# EAGLE design Loconet-QuadOD (EAGLE 7.7.0)
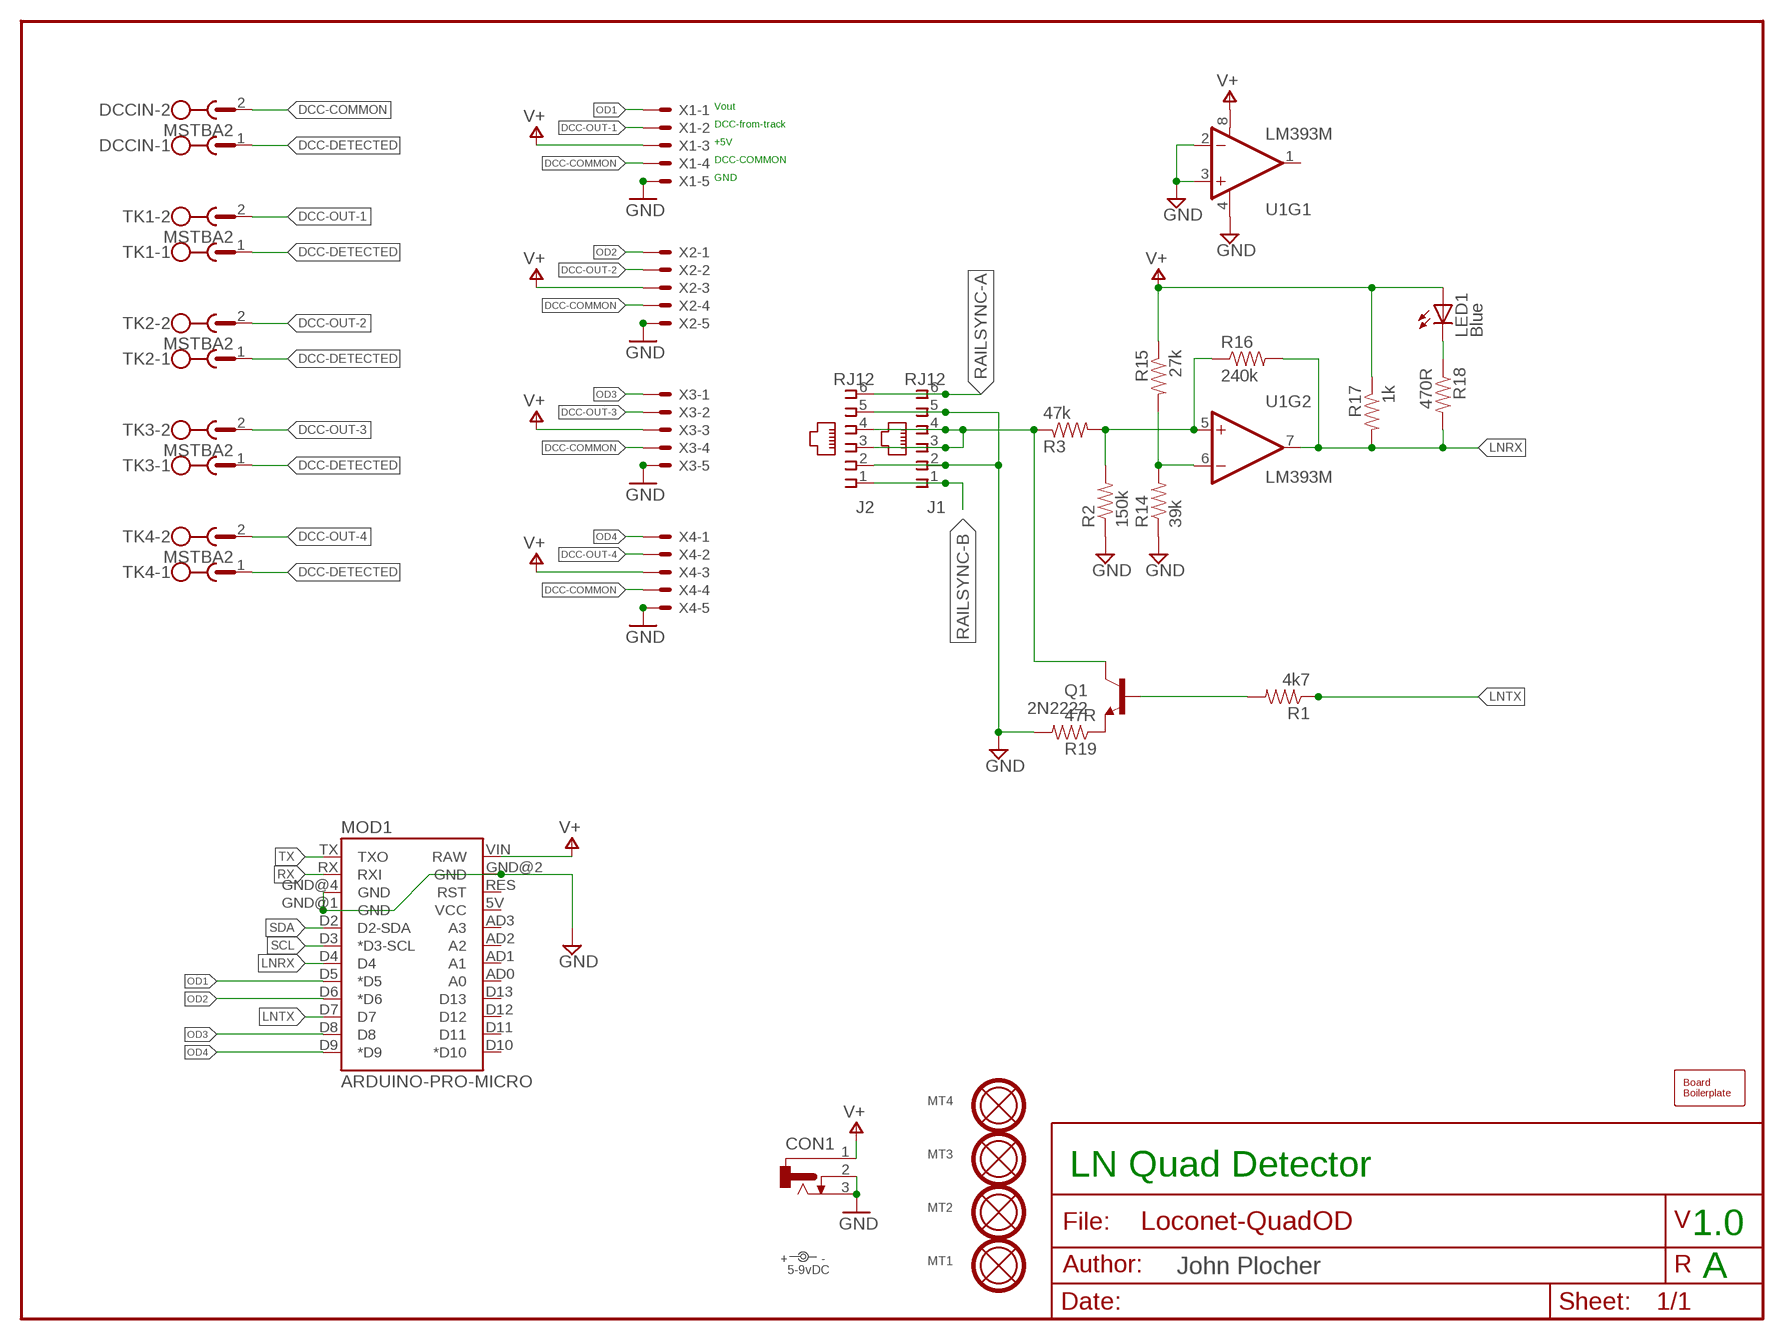
[diagram p0: schematic, sheet 1]

## Parts
BOARD1  BOARD100X100-NOHOLES  [BOARD-SEEED10X10-NOHOLES]
CON1  CONNECTOR-DC-POWER-RA  [DCJ0202]
DCCIN  MSTBA2  CONNECTOR-MSTBA2-ORIG  [MSTBA2]
J1  RJ12  CONNECTOR-RJ25CORCOM  [RJ25]
J2  RJ12  CONNECTOR-RJ25CORCOM  [RJ25]
LED1  Blue  LED0805-LED  [0805-LED]
MOD1  ARDUINO-PRO-MICRO  [ARDUINO-PRO-MICRO-NOSILK]
MT1  MOUNTINGHOLE  [MOUNTINGHOLE]
MT2  MOUNTINGHOLE  [MOUNTINGHOLE]
MT3  MOUNTINGHOLE  [MOUNTINGHOLE]
MT4  MOUNTINGHOLE  [MOUNTINGHOLE]
Q1  2N2222  NPN-SOT23  [SOT23]
R1  4k7  R0805-RES  [0805-RES]
R2  150k  R0805-RES  [0805-RES]
R3  47k  R0805-RES  [0805-RES]
R14  39k  R0805-RES  [0805-RES]
R15  27k  R0805-RES  [0805-RES]
R16  240k  R0805-RES  [0805-RES]
R17  1k  R0805-RES  [0805-RES]
R18  470R  R0805-RES  [0805-RES]
R19  47R  R0805-RES  [0805-RES]
TK1  MSTBA2  CONNECTOR-MSTBA2-ORIG  [MSTBA2]
TK2  MSTBA2  CONNECTOR-MSTBA2-ORIG  [MSTBA2]
TK3  MSTBA2  CONNECTOR-MSTBA2-ORIG  [MSTBA2]
TK4  MSTBA2  CONNECTOR-MSTBA2-ORIG  [MSTBA2]
U1  LM393M  [SO08]
U$1  5-9vDC  DOC-POWER_LABEL  [PWR_LABEL]
X1  KK-156-5  [KK-156-5]
X2  KK-156-5  [KK-156-5]
X3  KK-156-5  [KK-156-5]
X4  KK-156-5  [KK-156-5]

## Nets
DCC-COMMON: DCCIN.2 X1.4 X2.4 X3.4 X4.4
DCC-DETECTED: DCCIN.1 TK1.1 TK2.1 TK3.1 TK4.1
DCC-OUT-1: TK1.2 X1.2
DCC-OUT-2: TK2.2 X2.2
DCC-OUT-3: TK3.2 X3.2
DCC-OUT-4: TK4.2 X4.2
GND: CON1.2 CON1.3 J1.2 J1.5 J2.2 J2.5 MOD1.GND@1(GND) MOD1.GND@2(GND) MOD1.GND@4(GND) R2.1 R14.1 R19.2 U1.2(-IN) U1.3(+IN) U1.4(V-) X1.5 X2.5 X3.5 X4.5
LNRX: MOD1.D4 R16.2 R17.2 R18.2 U1.7(OUT)
LNTX: MOD1.D7 R1.1
LOCONET [Power]: J1.3 J1.4 J2.3 J2.4 Q1.3(C) R3.1
N$1: Q1.1(B) R1.2
N$2: LED1.C R18.1
N$4: R2.2 R3.2 R16.1 U1.5(+IN)
N$5: R14.2 R15.2 U1.6(-IN)
N$11: Q1.2(E) R19.1
OD1: MOD1.D5(*D5) X1.1
OD2: MOD1.D6(*D6) X2.1
OD3: MOD1.D8 X3.1
OD4: MOD1.D9(*D9) X4.1
RAILSYNC-A: J1.6 J2.6
RAILSYNC-B: J1.1 J2.1
RX [signals]: MOD1.RX(RXI)
SCL: MOD1.D3(*D3-SCL)
SDA: MOD1.D2(D2-SDA)
TX [signals]: MOD1.TX(TXO)
V+: CON1.1 LED1.A MOD1.VIN(RAW) R15.1 R17.1 U1.8(V+) X1.3 X2.3 X3.3 X4.3
Unconnected: MOD1.5V(VCC) MOD1.AD0(A0) MOD1.AD1(A1) MOD1.AD2(A2) MOD1.AD3(A3) MOD1.D10(*D10) MOD1.D11 MOD1.D12 MOD1.D13 MOD1.RES(RST) U1.1(OUT)

## Notes on the sheet
- Vout
- DCC-from-track
- +5V
- DCC-COMMON
- GND
- LN Quad Detector
- 1.0
- A

## Library data of the parts
BOARD1 = SPCoast:BOARD
CON1 = SPCoast:CONNECTOR-DC-POWER: DC POWER JACK Source: DCJ0202.pdf
DCCIN TK1-TK4 = SPCoast:CONNECTOR-MSTBA2-ORIG: PHOENIX; MF: FARNELL; MPN: 1757242; OC_FARNELL: 3705171; OC_NEWARK: 71C4161
J1 J2 = SPCoast:CONNECTOR-RJ25: AMP connector
LED1 = SPCoast:LED*
MOD1 = SPCoast:ARDUINO-PRO-MICRO
MT1-MT4 = SPCoast:MOUNTINGHOLE: Mounting hole with top and bottom copper and stop rings
Q1 = SPCoast:NPN: Transistor NPN BJT configuration in SOT23 package. MMBT2222 is the common NPN we use. Double check BCE configuration again layout.
R1-R3 R14-R19 = SPCoast:R*: Resistor Basic schematic elements and footprints for 0603, 1206, and PTH 1/10th watt (small) resistors.
U1 = SPCoast:LM393
U$1 = SPCoast:DOC-POWER_LABEL
X1-X4 = SPCoast:KK-156-5: KK 156 HEADER Source: http://www.molex.com/pdm_docs/sd/026604100_sd.pdf; OC_FARNELL: unknown; OC_NEWARK: unknown

## Net classes
0 default: width 0.203 mm, drill 0.5 mm
1 Power: width 0.305 mm, drill 0.6 mm
2 signals: width 0.254 mm, drill 0.5 mm

## Board
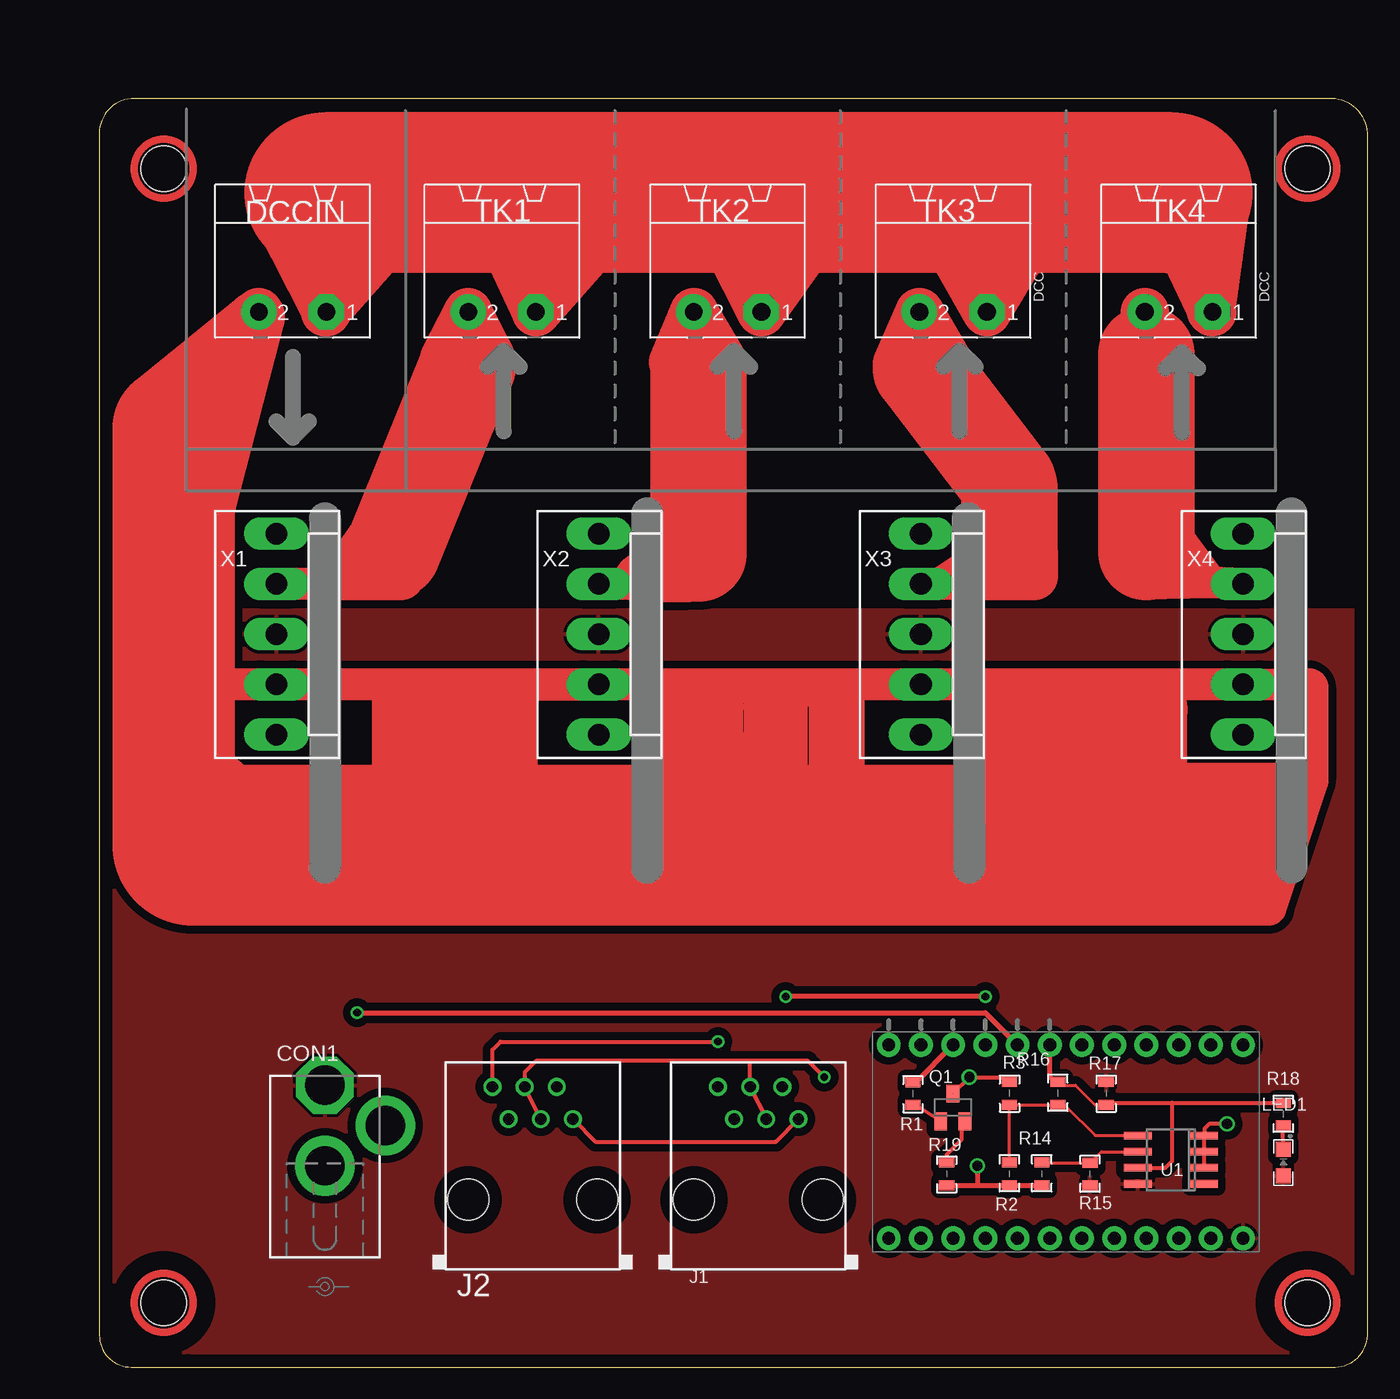
[diagram p1: board, top side]
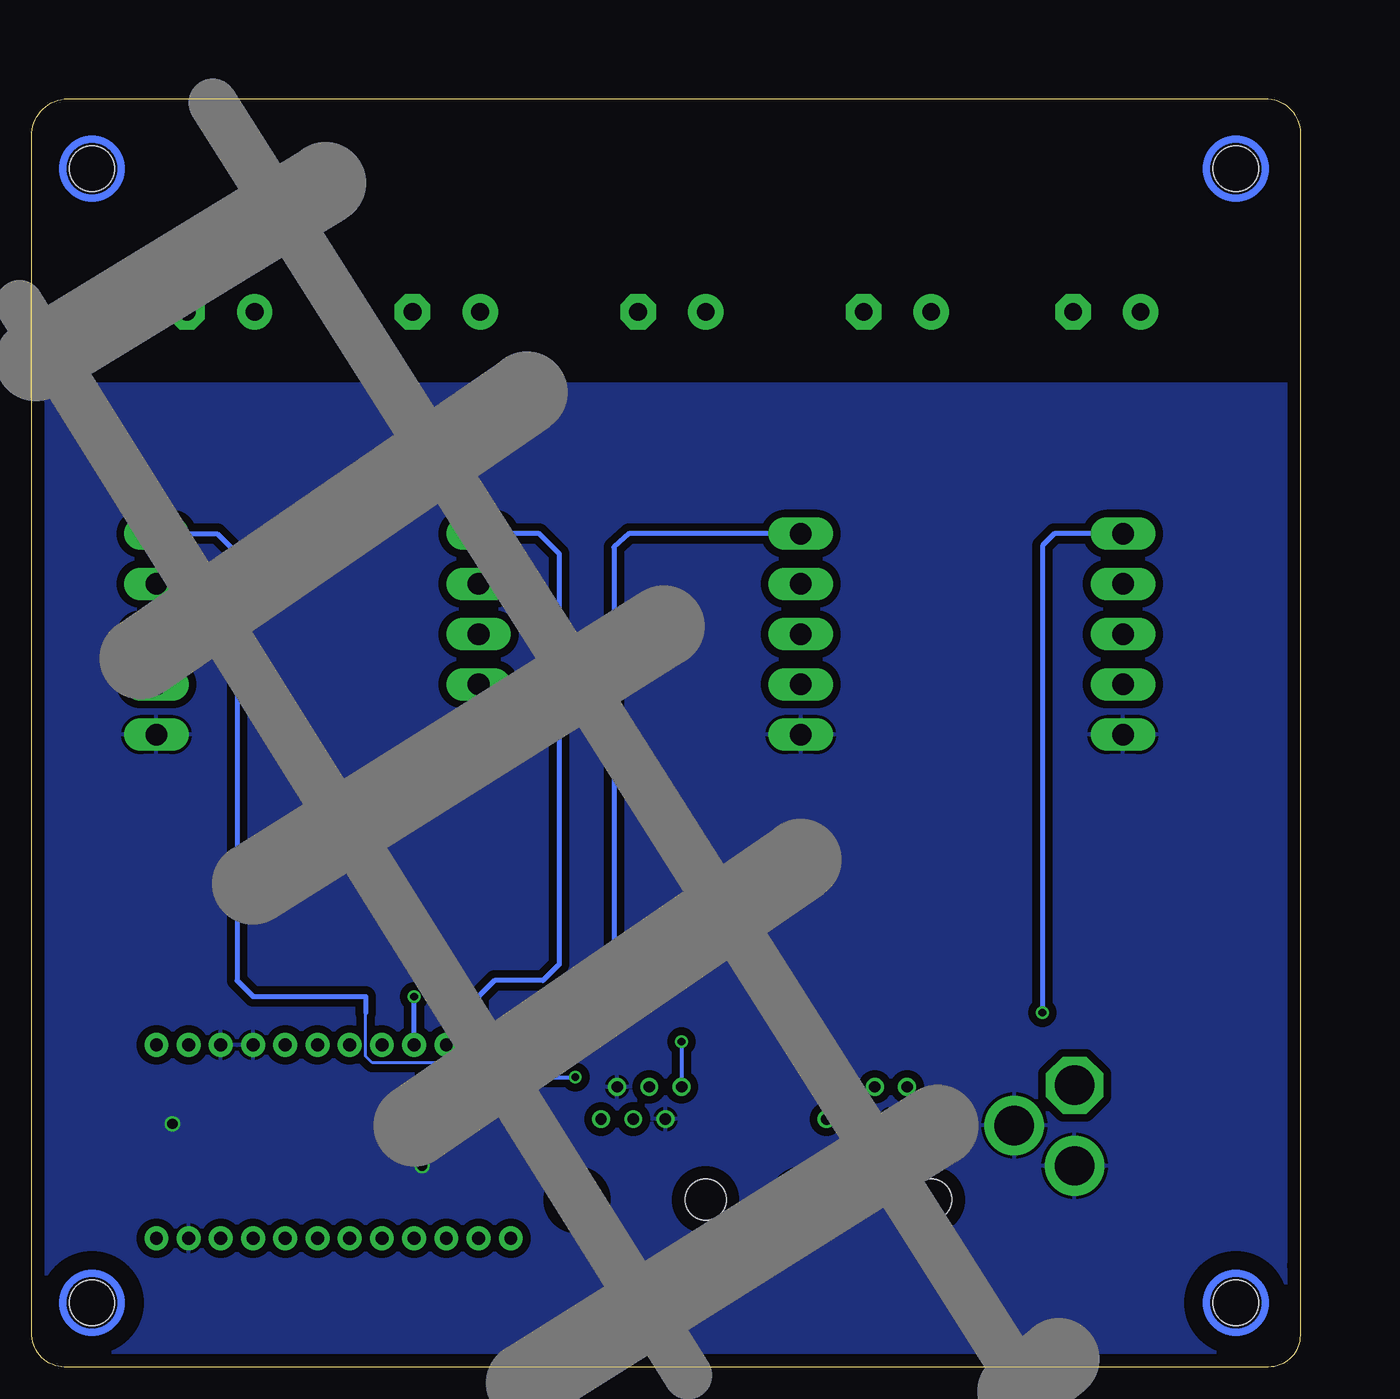
[diagram p2: board, bottom side, seen from below]

Size 100.01 x 100 mm. Coordinates in mm from the lower left corner, seen from the top.
Copper layers (1*16): Top 0.035mm / dielectric 1.5mm / Bottom 0.035mm
Design rules "default": minimum track width 10mil, minimum drill 24mil, track to track 8mil, track to pad 8mil, pad to pad 8mil, via to via 8mil, smd to smd 8mil, copper to edge 40mil, drill to drill 8mil, minimum pad ring 10mil, minimum via ring 8mil, stop-mask expansion 4mil, vias tented up to drill 0mil, thermal gap 10mil

### Footprints (pad centres in the part's own frame; a part is rotated, then mirrored left to right if it is on the bottom)
DCJ0202 = drill 3.1 pad 4.5 octagon: 1 0,3.175 | drill 3.1 pad 4.7: 2 4.763,0; 3 0,-3.175
MSTBA2 = drill 1.397 pad 2.794 octagon: 1 -2.667,5.08 | drill 1.397 pad 2.794: 2 2.667,5.08
RJ25 = drill 0.9 pad 1.4: 1 -3.175,8.89; 2 -1.905,6.35; 3 -0.635,8.89; 4 0.635,6.35; 5 1.905,8.89; 6 3.175,6.35 | hole 3.251: -5.08,0; 5.08,0
0805-LED = smd 1.2 x 1.2: A -1.05,0; C 1.05,0
ARDUINO-PRO-MICRO-NOSILK = drill 1.016 pad 1.88: 5V 7.62,5.08; AD0 7.62,-5.08; AD1 7.62,-2.54; AD2 7.62,0; AD3 7.62,2.54; D2 -7.62,2.54; D3 -7.62,0; D4 -7.62,-2.54; D5 -7.62,-5.08; D6 -7.62,-7.62; D7 -7.62,-10.16; D8 -7.62,-12.7; D9 -7.62,-15.24; D10 7.62,-15.24; D11 7.62,-12.7; D12 7.62,-10.16; D13 7.62,-7.62; GND@1 7.62,10.16; GND@2 -7.62,7.62; GND@4 -7.62,5.08; RES 7.62,7.62; RX -7.62,10.16; TX -7.62,12.7; VIN 7.62,12.7
MOUNTINGHOLE = hole 3.6: 0,0
SOT23 = smd 1 x 1.4: 1 -0.95,-1.1; 2 0.95,-1.1; 3 0,1.1
0805-RES = smd 0.8 x 1.2: 1 -0.9,0; 2 0.9,0
SO08 = smd 0.6 x 2.2: 1 -1.905,-2.6; 2 -0.635,-2.6; 3 0.635,-2.6; 4 1.905,-2.6; 5 1.905,2.6; 6 0.635,2.6; 7 -0.635,2.6; 8 -1.905,2.6
KK-156-5 = drill 1.7 pad 2.184 long: 1 -7.92,0; 2 -3.96,0; 3 0,0; 4 3.96,0; 5 7.92,0

### Placement (x,y rotation side)
BOARD1  0.01,0 0 top
CON1  17.79,19.05 0 top
DCCIN  15.25,88.27 180 top
J1  51.95,13.21 0 top
J2  34.17,13.21 0 top
LED1  93.35,16.13 90 top
MOD1  77.48,17.78 270 top
MT1  5.09,5.08 0 top
MT2  95.26,5.08 0 top
MT3  95.26,94.49 0 top
MT4  5.09,94.49 0 top
Q1  67.29,20.48 0 top
R1  64.14,21.57 270 top
R2  71.76,15.24 90 top
R3  71.76,21.59 270 top
R14  74.3,15.24 90 top
R15  78.11,15.22 90 top
R16  75.57,21.59 90 top
R17  79.38,21.59 270 top
R18  93.35,19.94 90 top
R19  66.81,15.24 270 top
TK1  31.76,88.27 180 top
TK2  49.54,88.27 180 top
TK3  67.32,88.27 180 top
TK4  85.1,88.27 180 top
U1  84.49,16.36 90 top
U$1  17.79,6.35 90 top
X1  13.98,57.79 270 top
X2  39.38,57.79 270 top
X3  64.78,57.79 270 top
X4  90.18,57.79 270 top

### Tracks (layer width: path | path; a pad name or v marks a point on that pad's centre or on a via)
DCC-COMMON
  Top 10.16: 7.5,43.31 6.74,42.68
  Top 11.43: 7.38,41.15 7.5,43.31
  Top 12.7: 81.29,41.15 7.38,41.15
  Top 2.54: 6.08,54.34 6.74,42.68 | 59.06,53.47 59.06,43.82 57.29,43.82 | 57.29,43.82 52.08,43.82 52.08,46.99 | 52.08,46.99 52.08,53.6 44.33,53.6 44.33,46.36 54.62,46.36 54.62,53.34 57.16,53.34 57.16,46.36 | 28.33,53.34 30.87,53.34 30.87,45.6 33.28,45.6 33.28,53.83 X2.4 | 28.33,45.98 25.28,45.98 | 25.28,52.96 22.74,53.72 22.74,43.69 | 95.39,53.57 95.39,53.85 93.99,53.85 X4.4 X3.4 X2.4 | 95.39,46.36 85.1,46.36 85.1,44.45 | 85.1,44.45 94.75,44.58 94.24,42.29 85.73,42.55 85.73,40.64 93.35,40.64 92.97,38.74 82.56,38.74 81.29,36.2 | X2.4 X1.4 9.38,53.83 8.9,53.34 | 57.29,43.69 57.29,43.82 | 82.56,43.31 83.32,44.45 85.1,44.45 | 72.4,49.53 69.86,52.07 | 69.86,52.07 69.86,53.34 | 69.86,52.07 69.86,46.99 | 52.08,46.99 49.54,49.53 49.54,52.07 47,52.07 arc60 49.54,46.99 47,46.99 45.73,48.26 45.73,52.07
  Top 2.794: 81.29,36.2 92.21,36.2 95.51,46.23
  Top 3.048: 28.33,53.34 28.33,45.98 | 25.28,45.98 25.28,52.96 | 95.39,53.57 95.39,46.36
  Top 3.81: DCCIN.2 12.07,82.68 9.28,76.71 12.07,82.81 4.07,76.33 8.77,67.57 12.71,82.68 12.71,82.93 6.74,73.66
  Top 6.452: 81.29,41.15 82.56,43.31 82.56,51.82 78.37,51.69 78.11,51.69 78.11,46.28 78.11,43.31 78.37,43.69 57.29,43.69
  Top 7.62: 78.11,46.28 74.86,49.53 72.4,49.53
  Top 9.652: 6.74,42.68 5.85,41.15 5.85,74.04 6.74,74.04 6.74,73.66
DCC-DETECTED
  Top 12.7: 84.59,92.59 73.67,92.59 53.98,92.59 35.57,92.59 17.79,92.59
  Top 3.81: DCCIN.1 13.98,90.81 22.87,88.9 17.79,83.19 17.79,92.59 17.92,93.98 | 84.59,92.59 88.91,92.46 87.64,83.32 TK4.1 85.35,88.27 | 73.67,92.59 69.99,92.84 73.16,88.52 TK3.1 66.18,89.92 | 53.98,92.59 52.21,92.84 56.02,88.52 TK2.1 48.14,91.19 | 35.57,92.59 34.43,92.84 38.62,87.89 TK1.1 29.85,92.97
DCC-OUT-1
  Top 2.54: X1.2 20.2,61.73 18.55,62.36 20.96,65.79
  Top 3.81: 23.12,64.39 23.76,62.36 18.55,62.36 | 29.09,79 27.19,79.51 TK1.2 30.87,79.63
  Top 7.62: 23.12,64.39 29.09,79
DCC-OUT-2
  Top 2.54: 42.55,62.23 42.4,61.75 X2.2 | 44.46,63.5 44.52,63.44 46.43,63.44
  Top 3.81: 44.46,63.5 44.59,62.23 | 47.25,64.14 46.43,63.44 46.36,63.38 46.36,62.23 43.19,62.23 | 44.46,63.5 42.55,62.23 43.19,62.23 | 44.46,63.5 45.09,64.14 45.73,64.14 43.19,62.23 | 47.25,78.36 45.22,79.25 | 45.22,79.25 TK2.2 49.29,79.12 45.22,79.25
  Top 7.62: 47.25,64.14 47.25,78.36
DCC-OUT-3
  Top 2.54: 68.59,62.36 68.82,61.75 66.23,61.75 | 66.23,61.75 X3.2 | 66.23,61.75 69.99,64.27
  Top 3.81: 71.64,69.73 71.76,69.35 | 71.76,64.39 73.67,64.14 73.67,62.36 68.59,62.36 | 64.78,78.74 62.87,79.12 TK3.2 67.32,78.62
  Top 7.62: 71.76,69.35 71.76,64.39 | 71.64,69.73 64.78,78.74
DCC-OUT-4
  Top 2.54: X4.2 87.69,61.86 | 87.69,61.86 82.31,61.75 82.18,63.25 82.56,64.27 | 87.69,61.86 84.21,66.55
  Top 3.81: TK4.2 82.56,79.89
  Top 7.62: 82.56,79.89 82.56,64.27
GND  (via drill 0.8)
  Top 0.305: U1.2 U1.3 U1.4 87.13,18.31 87.13,18.8 87.51,19.18 v88.91,19.18 | R19.2
  Top 0.406: R19.2 69.22,14.34 | 69.22,14.34 R2.1 R14.1 | v69.22,15.88 69.22,14.34
  pour Bottom (isolate 0.61): 100.34,77.47 100.34,0 0.01,0 0.01,77.47
LNRX
  Top 0.254: R16.2 75.84,22.23 76.97,22.23 78.51,20.69 R17.2
  Top 0.305: 93.22,20.83 R18.2 84.59,20.84 | R17.2 79.38,20.84 84.59,20.84 | U1.7 84.06,15.73 84.59,16.26 84.59,20.84
  Top 0.406: R16.2 74.94,22.86 MOD1.D4
LNTX
  Top 0.254: R1.1 64.38,22.47
  Top 0.406: 64.38,22.47 MOD1.D7
LOCONET  (via drill 0.6, 0.8)  (1 unrouted)
  Top 0.305: 67.32,21.58 67.32,21.59 v68.59,22.86 71.52,22.86 R3.1 | J2.4 J2.3 33.54,23.24 34.43,24.13 51.32,24.13 | J1.4 J1.3 51.32,24.13 | v57.16,22.86 55.89,24.13 51.32,24.13
  Bottom 0.305: 33.66,22.23 J2.3 | v68.59,22.86 v57.16,22.86
N$1
  Top 0.254: Q1.1 64.22,20.75 R1.2
N$2
  Top 0.305: LED1.C 93.3,18.93 R18.1
N$4
  Top 0.254: R2.2 R3.2 R16.1 76.21,20.58 78.52,18.27 U1.5
N$5
  Top 0.254: R14.2 74.33,16.12 R15.2 79.01,17 U1.6
N$11
  Top 0.305: Q1.2 67.95,19.19 67.95,17.91 66.81,16.77 R19.1
OD1  (via drill 0.6)
  Top 0.406: v20.33,27.94 69.86,27.94 MOD1.D5
  Bottom 0.406: X1.1 19.39,65.71 20.33,64.77 v20.33,27.94
OD2  (via drill 0.6)
  Top 0.406: v69.86,29.21 v54.11,29.21
  Bottom 0.406: X2.1 52.92,65.71 54.11,64.65 v54.11,29.21 | MOD1.D6 v69.86,29.21
OD3
  Bottom 0.406: X3.1 60,65.71 58.43,64.14 58.43,31.75 59.7,30.48 63.51,30.48 64.78,29.21 MOD1.D8
OD4
  Bottom 0.254: MOD1.D9 63.64,24.01 73.16,24.01 73.67,24.51 73.67,27.94
  Bottom 0.406: X4.1 85.4,65.71 83.83,64.14 83.83,30.48 82.56,29.21 73.67,29.21 73.67,27.94
RAILSYNC-A
  Top 0.305: J2.6 39.13,17.78 53.35,17.78 J1.6
RAILSYNC-B  (via drill 0.6)
  Top 0.305: J2.1 31,25.02 31.63,25.66 v48.78,25.66
  Bottom 0.305: v48.78,25.66 J1.1
V+
  pour Top (isolate 0.61): 100.21,59.69 100.34,0 0.01,0 -0.12,59.69

### Text on the board
tNames: DCC | DCC
tDocu: V1.0A | DCC IN | Block 1 | Block 2 | Block 3 | Block 4 | John Plocher | 2018-12 | Det / / Com | Det / / Com | Det / / Com | Det / / Com | Det / / Com | DCC Booster | Track Blocks | LN-QuadOD | Detect | TRACK | V+ | COMMON | GND | GND | GND | GND | CP-OD / -or- / DCCOD | 1 | 2 | 3 | 4 | LNTX | LNRX | Activity | * | Arduino Pro-Micro / ATmega32U4 | To Lnet | To Lnet
bDocu: LN-QuadOD | Go Bears! | LN Quad OD detector / Use with MRRWA Library: https://mrrwa.org/ | Inspired by railnerd, MFS, MRCS, / RR-Cirkits and, of course, / Dr Bruce Chubb | Made in the PCR, Coast Division, NMRA | Model Railroading is Fun! | www. SPCoast .com